# EAGLE schematic untitled (EAGLE 9.6.2)
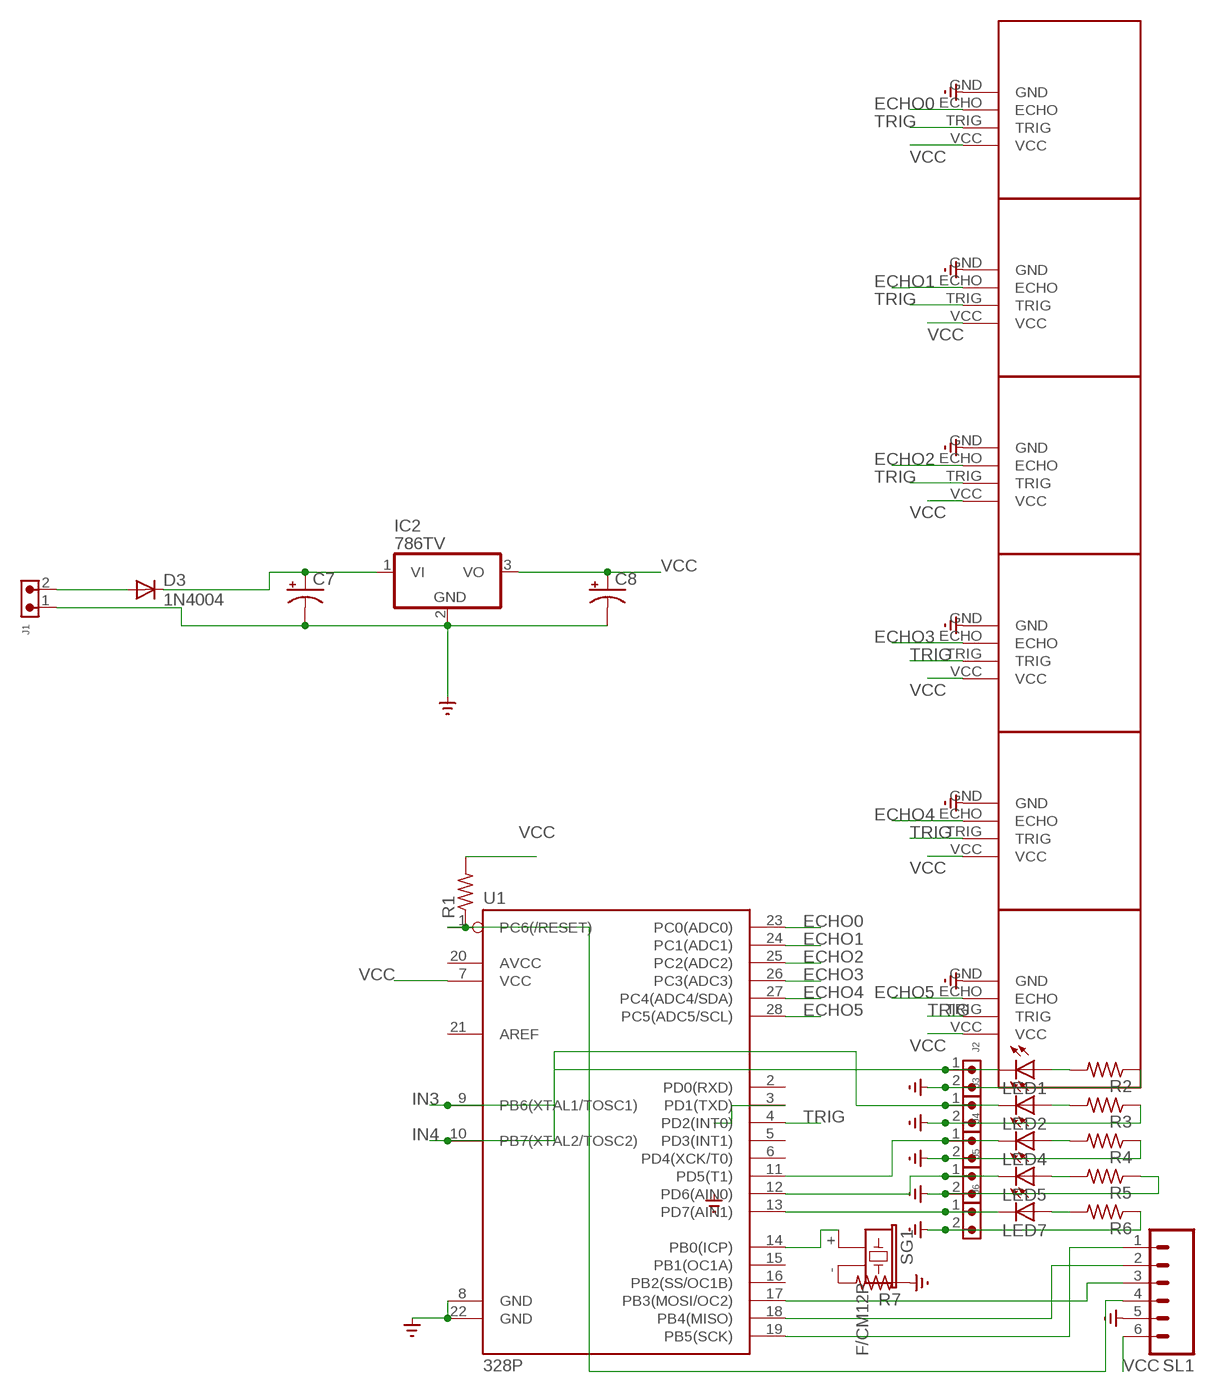
[diagram p0: schematic, sheet 1]

## Parts
C7  CAPACITOR-PE5-10.5  [E5-10,5]
C8  CAPACITOR-PE5-6  [E5-6]
D3  1N4004  [DO41-10]
IC2  786TV  [TO220V]
J1  691305530002  [691305530002]
J2  691305530002  [691305530002]
J3  691305530002  [691305530002]
J4  691305530002  [691305530002]
J5  691305530002  [691305530002]
J6  691305530002  [691305530002]
LED1  LED5MM  [LED5MM]
LED2  LED5MM  [LED5MM]
LED4  LED5MM  [LED5MM]
LED5  LED5MM  [LED5MM]
LED7  LED5MM  [LED5MM]
R1  R-US_0207/9  [0207/9]
R2  R-US_0207/9  [0207/9]
R3  R-US_0207/9  [0207/9]
R4  R-US_0207/9  [0207/9]
R5  R-US_0207/9  [0207/9]
R6  R-US_0207/9  [0207/9]
R7  R-US_0207/9  [0207/9]
SG1  F/CM12P  [F/CM12P]
SL1  M06  [06P]
U1  328P  ATMEGA328P_PDIP  [DIP28]
U$1  SRO4M  [SRO4M]
U$2  SRO4M  [SRO4M]
U$3  SRO4M  [SRO4M]
U$4  SRO4M  [SRO4M]
U$5  SRO4M  [SRO4M]
U$6  SRO4M  [SRO4M]

## Nets
ECHO0: U1.23(PC0(ADC0)) U$6.ECHO
ECHO1: U1.24(PC1(ADC1)) U$1.ECHO
ECHO2: U1.25(PC2(ADC2)) U$2.ECHO
ECHO3: U1.26(PC3(ADC3)) U$4.ECHO
ECHO4: U1.27(PC4(ADC4/SDA)) U$3.ECHO
ECHO5: U1.28(PC5(ADC5/SCL)) U$5.ECHO
GND: C7.- C8.- IC2.2(GND) J1.1 J2.2 J3.2 J4.2 J5.2 J6.2 R2.1 R3.1 R4.1 R5.1 R6.1 R7.1 SL1.5 U1.8(GND) U1.22(GND) U$1.GND U$2.GND U$3.GND U$4.GND U$5.GND U$6.GND ; supply symbol labelled SUPPLY_BRASTAN_GND_
IN3: J2.1 LED1.K(C) U1.9(PB6(XTAL1/TOSC1))
IN4: J3.1 LED2.K(C) U1.10(PB7(XTAL2/TOSC2))
N$1: D3.A J1.2
N$2: J6.1 LED7.K(C) U1.13(PD7(AIN1))
N$3: SL1.1 U1.19(PB5(SCK))
N$4: SL1.2 U1.18(PB4(MISO))
N$5: C7.+ D3.C IC2.1(VI)
N$6: R1.1 SL1.4 U1.1(PC6(/RESET))
N$7: SG1.+ U1.14(PB0(ICP))
N$8: R7.2 SG1.-
N$9: J4.1 LED4.K(C) U1.11(PD5(T1))
N$11: U1.3(PD1(TXD))
N$12: LED2.A R3.2
N$13: J5.1 LED5.K(C) U1.12(PD6(AIN0))
N$14: LED5.A R5.2
N$15: LED7.A R6.2
N$16: LED4.A R4.2
N$17: LED1.A R2.2
RL: SL1.3 U1.17(PB3(MOSI/OC2))
TRIG: U1.4(PD2(INT0)) U$1.TRIG U$2.TRIG U$3.TRIG U$4.TRIG U$5.TRIG U$6.TRIG
VCC: C8.+ IC2.3(VO) R1.2 SL1.6 U1.7(VCC) U$1.VCC U$2.VCC U$3.VCC U$4.VCC U$5.VCC U$6.VCC
Unconnected: U1.2(PD0(RXD)) U1.5(PD3(INT1)) U1.6(PD4(XCK/T0)) U1.15(PB1(OC1A)) U1.16(PB2(SS/OC1B)) U1.20(AVCC) U1.21(AREF)

## Library data of the parts
C7 C8 = BeagleBone_Blue_R3:CAPACITOR-P: POLARIZED CAPACITOR, American symbol
D3 = adafruit:1N4004: DIODE General purpose 1N400x type rectifier (With bigger pads) http://www.ladyada.net/library/pcb/eaglelibrary.html
IC2 = linear:78*: Positive VOLTAGE REGULATOR Source: http://cache.national.com/ds/LM/LM78L05.pdf http://www.fairchildsemi.com/ds/LM/LM7805.pdf
J1-J6 = Wurth_Connectors_WR-TBL Pluggable Connector:691305530002: WR-TBL Serie 3055 - 5,08 mm - PCB Header Vertical Entry with Plastic Latches KIND PROPERTIES Pitch 5.08 mm MATERIAL PROPERTIES Insulator Material PA66 Insulator Flammability Rating UL94 V-0 Insulator Color Green Terminal Material Copper Alloy Terminal Plating Tin-plated surface GENERAL INFORMATION Operating Temperature -40 up to +105 °C ELECTRICAL PROPERTIES IR UL 16 A Working Voltage [UL] 300 V (AC) Withstanding Voltage [UL] 2500 V (AC) Contact Resistance [UL] 20 mΩ CERTIFICATION UL Approval E315414 <https://www.we-online.com/catalog/media/o135349v209%20Family_WR-TBL3_6913055300xx.jpg> Details see: https://www.we-online.com/catalog/en/TBL_5_08_3055_6913055300XX/ Updated by Ella Wu 2019-12-30 2019(C) Wurth Elektronik; DATASHEET-URL: https://www.we-online.com/catalog/datasheet/691305530002.pdf; IR-UL: 16A; MOUNT: THT; PART-NUMBER: 691305530002; PINS: 2; PITCH: 5.08mm; TYPE: Vertical; WORKING-VOLTAGE-UL: 300V (AC)
LED1 LED2 LED4 LED5 LED7 = adafruit:LED: LED OSRAM: - CHIPLED LG R971, LG N971, LY N971, LG Q971, LY Q971, LO R971, LY R971 LH N974, LH R974 LS Q976, LO Q976, LY Q976 LO Q996 - Hyper CHIPLED LW Q18S LB Q993, LB Q99A, LB R99A - SideLED LS A670, LO A670, LY A670, LG A670, LP A670 LB A673, LV A673, LT A673, LW A673 LH A674 LY A675 LS A676, LA A676, LO A676, LY A676, LW A676 LS A679, LY A679, LG A679 - Hyper Micro SIDELED® LS Y876, LA Y876, LO Y876, LY Y876 LT Y87S - SmartLED LW L88C, LW L88S LB L89C, LB L89S, LG L890 LS L89K, LO L89K, LY L89K LS L896, LA L896, LO L896, LY L896 - TOPLED LS T670, LO T670, LY T670, LG T670, LP T670 LSG T670, LSP T670, LSY T670, LOP T670, LYG T670 LG T671, LOG T671, LSG T671 LB T673, LV T673, LT T673, LW T673 LH T674 LS T676, LA T676, LO T676, LY T676, LB T676, LH T676, LSB T676, LW T676 LB T67C, LV T67C, LT T67C, LS T67K, LO T67K, LY T67K, LW E67C LS E67B, LA E67B, LO E67B, LY E67B, LB E67C, LV E67C, LT E67C LW T67C LS T679, LY T679, LG T679 LS T770, LO T770, LY T770, LG T770, LP T770 LB T773, LV T773, LT T773, LW T773 LH T774 LS E675, LA E675, LY E675, LS T675 LS T776, LA T776, LO T776, LY T776, LB T776 LHGB T686 LT T68C, LB T68C - Hyper Mini TOPLED® LB M676 - Mini TOPLED Santana® LG M470 LS M47K, LO M47K, LY M47K Source: http://www.osram.convergy.de/
R1-R7 = adafruit:R-US_: RESISTOR, American symbol
SG1 = buzzer:F/CM12P: BUZZER Source: Buerklin; OC_FARNELL: unknown; OC_NEWARK: unknown
SL1 = con-amp-quick:M06: AMP QUICK CONNECTOR; OC_FARNELL: unknown; OC_NEWARK: unknown
U1 = SparkFun-IC-Microcontroller:ATMEGA328P_PDIP: Atmel 328P Through hole ATMEGA328P uC used in the Arduino 32kb flash, 1k EEPROM, 2k SRAM Datasheet <http://www.sparkfun.com/datasheets/Components/SMD/ATMega328.pdf> SparkFun Products Storefront component: AVR 28 Pin 20MHz 32K 6A/D - ATMega328P <https://www.sparkfun.com/products/9061> (COM-09061) SparkFun Simon Says - Through-Hole Soldering Kit <https://www.sparkfun.com/products/10547> (KIT-10547) SparkFun Learn to Solder - Simon Says <https://www.sparkfun.com/products/13708> (KIT-13708) SparkFun BigTime Watch Kit <https://www.sparkfun.com/products/11734> (KIT-11734) SparkFun ClockIt <https://www.sparkfun.com/products/10930> (KIT-10930) SparkFun Serial Enabled LCD Kit <https://www.sparkfun.com/products/10097> (LCD-10097) SparkFun Simon Tilts - Through Hole Soldering Kit <https://www.sparkfun.com/products/12634> (KIT-12634) SparkFun Frequency Counter Kit <https://www.sparkfun.com/products/10140> (KIT-10140) FabFM Radio Kit <https://www.sparkfun.com/products/11043> (KIT-11043) SparkFun Binary Blaster Kit <https://www.sparkfun.com/products/12037> (KIT-12037) SparkFun Metro-Gnome <https://www.sparkfun.com/products/9236> (KIT-09236) ATmega328 with Arduino Optiboot (Uno) <https://www.sparkfun.com/products/10524> (DEV-10524); PROD_ID: IC-09136
U$1-U$6 = SRO4M:SRO4M